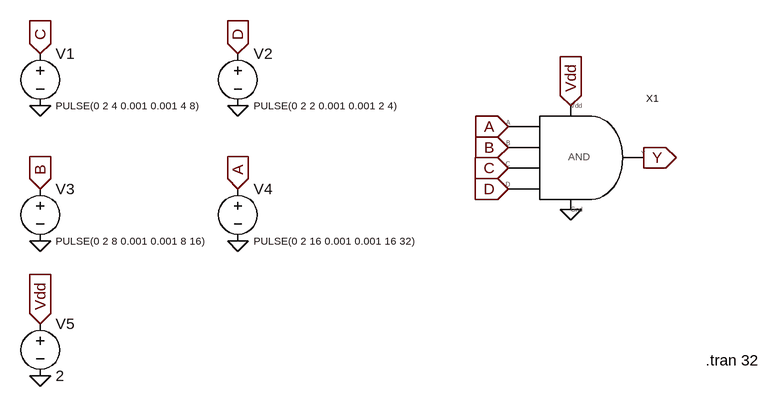
[diagram p0: schematic 4and symbol.asc]
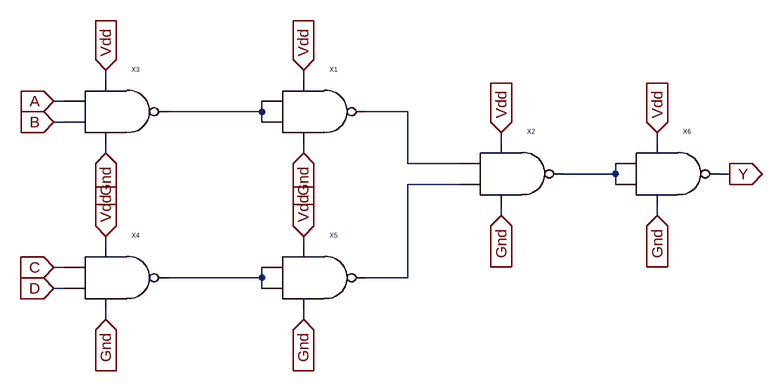
[diagram p1: sub-circuit 4and.asc]
4and symbol.asc, the LTspice schematic file:
Version 4
SHEET 1 880 680
FLAG -800 320 Vdd
IOPIN -800 320 In
FLAG -496 -96 D
IOPIN -496 -96 In
FLAG -800 -96 C
IOPIN -800 -96 In
FLAG -800 112 B
IOPIN -800 112 In
FLAG -800 400 0
FLAG -496 192 0
FLAG -800 192 0
FLAG -800 -16 0
FLAG -496 -16 0
FLAG -496 112 A
IOPIN -496 112 In
FLAG -80 16 A
IOPIN -80 16 In
FLAG -80 48 B
IOPIN -80 48 In
FLAG -80 80 C
IOPIN -80 80 In
FLAG -80 112 D
IOPIN -80 112 In
FLAG 16 -16 Vdd
IOPIN 16 -16 In
FLAG 16 144 0
FLAG 128 64 Y
IOPIN 128 64 Out
SYMBOL 4and -16 48 R0
SYMATTR InstName X1
SYMBOL voltage -800 -112 R0
WINDOW 3 24 96 Left 1
WINDOW 123 0 0 Left 0
WINDOW 39 0 0 Left 0
SYMATTR Value PULSE(0 2 4 0.001 0.001 4 8)
SYMATTR InstName V1
SYMBOL voltage -496 -112 R0
WINDOW 3 24 96 Left 1
WINDOW 123 0 0 Left 0
WINDOW 39 0 0 Left 0
SYMATTR Value PULSE(0 2 2 0.001 0.001 2 4)
SYMATTR InstName V2
SYMBOL voltage -800 96 R0
WINDOW 3 24 96 Left 1
WINDOW 123 0 0 Left 0
WINDOW 39 0 0 Left 0
SYMATTR Value PULSE(0 2 8 0.001 0.001 8 16)
SYMATTR InstName V3
SYMBOL voltage -496 96 R0
WINDOW 3 24 96 Left 1
WINDOW 123 0 0 Left 0
WINDOW 39 0 0 Left 0
SYMATTR Value PULSE(0 2 16 0.001 0.001 16 32)
SYMATTR InstName V4
SYMBOL voltage -800 304 R0
WINDOW 123 0 0 Left 0
WINDOW 39 0 0 Left 0
SYMATTR InstName V5
SYMATTR Value 2
TEXT 224 376 Left 2 !.tran 32

4and.asc, the sub-circuit schematic file:
Version 4
SHEET 1 880 680
WIRE -368 -48 -368 -64
WIRE -64 -48 -64 -64
WIRE -432 -16 -448 -16
WIRE -128 0 -128 -16
WIRE -128 0 -272 0
WIRE 96 0 32 0
WIRE -432 16 -448 16
WIRE -128 16 -128 0
WIRE 240 48 240 32
WIRE 480 48 480 32
WIRE -368 64 -368 48
WIRE -64 64 -64 48
WIRE 96 80 96 0
WIRE 176 80 96 80
WIRE 416 96 416 80
WIRE 416 96 336 96
WIRE 592 96 576 96
WIRE 176 112 96 112
WIRE 416 112 416 96
WIRE 240 160 240 144
WIRE 480 160 480 144
WIRE -368 208 -368 192
WIRE -64 208 -64 192
WIRE -432 240 -448 240
WIRE -128 256 -128 240
WIRE -128 256 -272 256
WIRE 96 256 96 112
WIRE 96 256 32 256
WIRE -432 272 -448 272
WIRE -128 272 -128 256
WIRE -368 320 -368 304
WIRE -64 320 -64 304
FLAG -368 -64 Vdd
IOPIN -368 -64 In
FLAG -64 -64 Vdd
IOPIN -64 -64 In
FLAG -368 192 Vdd
IOPIN -368 192 In
FLAG -64 192 Vdd
IOPIN -64 192 In
FLAG 240 32 Vdd
IOPIN 240 32 In
FLAG -448 -16 A
IOPIN -448 -16 In
FLAG -448 16 B
IOPIN -448 16 In
FLAG -448 240 C
IOPIN -448 240 In
FLAG -448 272 D
IOPIN -448 272 In
FLAG -64 64 Gnd
IOPIN -64 64 In
FLAG -368 64 Gnd
IOPIN -368 64 In
FLAG -368 320 Gnd
IOPIN -368 320 In
FLAG -64 320 Gnd
IOPIN -64 320 In
FLAG 240 160 Gnd
IOPIN 240 160 In
FLAG 480 32 Vdd
IOPIN 480 32 In
FLAG 480 160 Gnd
IOPIN 480 160 In
FLAG 592 96 Y
IOPIN 592 96 Out
SYMBOL nand -64 0 R0
SYMATTR InstName X1
SYMBOL nand 240 96 R0
SYMATTR InstName X2
SYMBOL nand -368 0 R0
SYMATTR InstName X3
SYMBOL nand -368 256 R0
SYMATTR InstName X4
SYMBOL nand -64 256 R0
SYMATTR InstName X5
SYMBOL nand 480 96 R0
SYMATTR InstName X6

The netlist it stands for:
* 4and symbol.asc
XX1 Vdd 0 A B C D Y 4and
V1 C 0 PULSE(0 2 4 0.001 0.001 4 8)
V2 D 0 PULSE(0 2 2 0.001 0.001 2 4)
V3 B 0 PULSE(0 2 8 0.001 0.001 8 16)
V4 A 0 PULSE(0 2 16 0.001 0.001 16 32)
V5 Vdd 0 2

* block symbol definitions
.subckt 4and Vdd Gnd A B C D Y
XX1 N001 N001 Vdd Gnd N002 nand  ; pins A B vdd gnd Y
XX2 N002 N004 Vdd Gnd N003 nand  ; pins A B vdd gnd Y
XX3 A B Vdd Gnd N001 nand  ; pins A B vdd gnd Y
XX4 C D Vdd Gnd N005 nand  ; pins A B vdd gnd Y
XX5 N005 N005 Vdd Gnd N004 nand  ; pins A B vdd gnd Y
XX6 N003 N003 Vdd Gnd Y nand  ; pins A B vdd gnd Y
.ends 4and

.tran 32
.backanno
.end

* Results of the author's LTspice run, read from the files saved beside the schematic
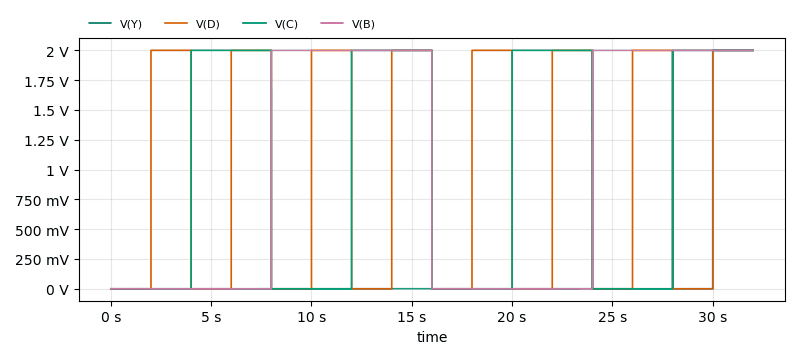
[diagram p2: Transient Analysis of 4and symbol.asc, plotted from the saved traces]
* Transient Analysis, 1 run:
*   V(Y): min 401 nV, max 2 V, average 125.1 mV, rms 500.3 mV, last 2 V
*   V(D): min 0 V, max 2 V, average 1 V, rms 1.414 V, last 2 V
*   V(C): min 0 V, max 2 V, average 1 V, rms 1.414 V, last 2 V
*   V(B): min 0 V, max 2 V, average 1 V, rms 1.414 V, last 2 V